# EAGLE design MiniDC2 (EAGLE 7.6.0)
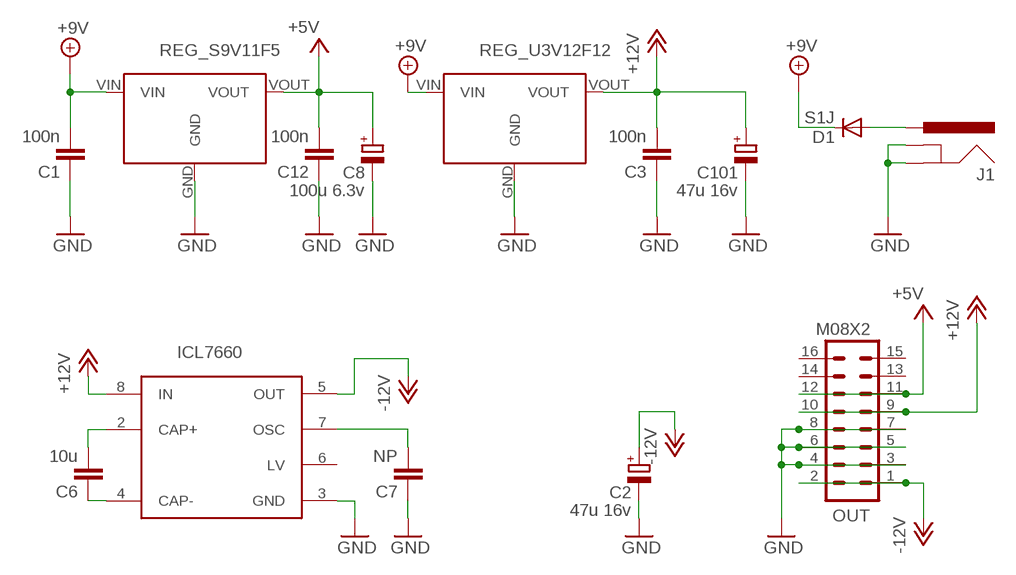
[diagram p0: schematic, sheet 1]

## Parts
C1  100n  C-EUC0603  [C0603]
C2  47u 16v  CPOL-EUB  [PANASONIC_B]
C3  100n  C-EUC0603  [C0603]
C6  10u  C-EUC1206  [C1206]
C7  NP  C-EUC0603  [C0603]
C8  100u 6.3v  CPOL-EUB  [PANASONIC_B]
C12  100n  C-EUC0603  [C0603]
C101  47u 16v  CPOL-EUB  [PANASONIC_B]
D1  S1J  DIODESMA  [SMA-DIODE]
J1  POWER_JACKPTH  [POWER_JACK_PTH]
OUT  M08X2  [2X8]
U1  REG_S9V11F5  [REG_S9V11F5]
U2  REG_U3V12F12  REG_S9V11F5  [REG_S9V11F5]
U3  ICL7660  [SOIC8]

## Nets
+5V: C8.+ C12.2 OUT.11 OUT.12 U1.VOUT
+9V: C1.2 D1.C U1.VIN U2.VIN
+12V: C3.2 C101.+ OUT.9 OUT.10 U2.VOUT U3.8(IN)
-12V: C2.+ OUT.1 OUT.2 U3.5(OUT)
GND: C1.1 C2.- C3.1 C7.1 C8.- C12.1 C101.- J1.GND J1.GNDBREAK OUT.3 OUT.4 OUT.5 OUT.6 OUT.7 OUT.8 U1.GND U2.GND U3.3(GND)
N$2: D1.A J1.PWR
N$3: C6.1 U3.4(CAP-)
N$4: C6.2 U3.2(CAP+)
N$5: C7.2 U3.7(OSC)
Unconnected: OUT.13 OUT.14 OUT.15 OUT.16 U3.6(LV)

## Library data of the parts
C1 C3 C6 C7 C12 = rcl:C-EU: CAPACITOR, European symbol
C2 C8 C101 = Rebel:CPOL-EU: POLARIZED CAPACITOR, European symbol
D1 = SparkFun:DIODE: Diode These are standard reverse protection diodes and small signal diodes. SMA package can handle up to about 1A. SOD-323 can handle about 200mA. What the SOD-323 package when ordering, there are some mfgs out there that are 5-pin packages.
J1 = SparkFun:POWER_JACK: Power Jack This is the standard 5.5mm barrel jack for power. The PTH is the most common, proven, reliable, footprint. All others are experimental. The Slot footprint only works if the mill layer is transmitted to the PCB fab house so be warned. Spark Fun Electronics SKU : PRT-00119. Mating wall wart : TOL-00298 (and others)
OUT = SparkFun:M08X2
U1 U2 = Rebel:REG_S9V11F5
U3 = Rebel:ICL7660

## Net classes
1 power: width 0.178 mm, drill 0.305 mm, clearance 0.178 mm to class 0, clearance 0.178 mm

## Board
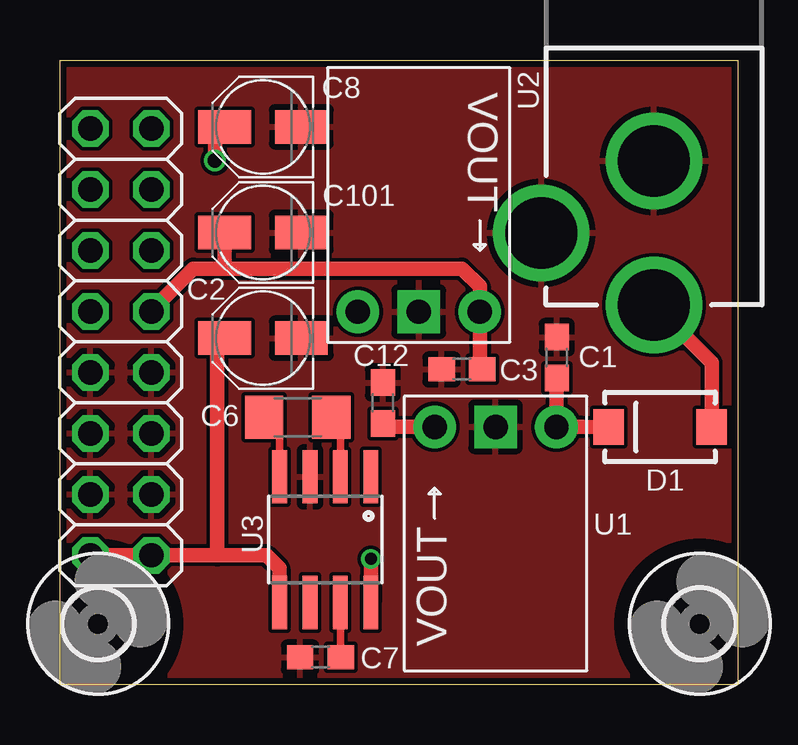
[diagram p1: board, top side]
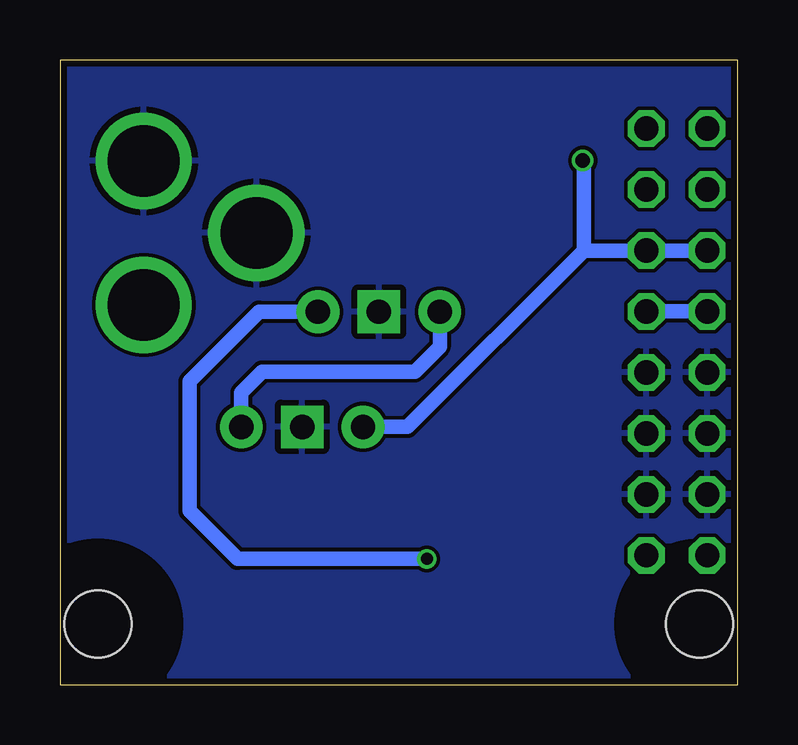
[diagram p2: board, bottom side, seen from below]

Size 28.26 x 26.04 mm. Coordinates in mm from the lower left corner, seen from the top.
Outline: 0,0 0,26.04 28.26,26.04 28.26,0 0,0
Copper layers (1*16): Top 0.035mm / dielectric 1.5mm / Bottom 0.035mm
Design rules "SeeedStudio_2layer_DRU_no_angle_20140221": minimum track width 6mil, minimum drill 12mil, track to track 6mil, track to pad 6mil, pad to pad 6mil, via to via 6mil, smd to smd 0mil, copper to edge 10mil, drill to drill 10mil, minimum pad ring 10mil, minimum via ring 6mil, stop-mask expansion 2mil, vias tented up to drill 100mil, thermal gap 10mil

### Footprints (pad centres in the part's own frame; a part is rotated, then mirrored left to right if it is on the bottom)
C0603 = smd 1.1 x 1: 1 -0.85,0; 2 0.85,0
PANASONIC_B = smd 2.2 x 1.4: + 1.6,0; - -1.6,0
C1206 = smd 1.6 x 1.8: 1 -1.4,0; 2 1.4,0
SMA-DIODE = smd 1.27 x 1.47: A -2.15,0; C 2.15,0
POWER_JACK_PTH = drill 2.997: GND 0,7.7; GNDBREAK 4.7,10.7; PWR 0,13.7
2X8 = drill 1.016 octagon: 1 0,0; 2 0,2.54; 3 2.54,0; 4 2.54,2.54; 5 5.08,0; 6 5.08,2.54; 7 7.62,0; 8 7.62,2.54; 9 10.16,0; 10 10.16,2.54; 11 12.7,0; 12 12.7,2.54; 13 15.24,0; 14 15.24,2.54; 15 17.78,0; 16 17.78,2.54
REG_S9V11F5 = drill 1.016 pad 1.778 square: GND 0,0 | drill 1.016 pad 1.778: VIN -2.54,0; VOUT 2.54,0
SOIC8 = smd 0.61 x 2.21: 1 -1.905,-2.616; 2 -0.635,-2.616; 3 0.635,-2.616; 4 1.905,-2.616; 5 1.905,2.616; 6 0.635,2.616; 7 -0.635,2.616; 8 -1.905,2.616
2,8 = hole 2.8: 0,0

### Placement (x,y rotation side)
C1  20.71,13.64 270 top
C2  8.46,14.45 180 top
C3  16.76,13.15 0 top
C6  9.91,11.15 0 top
C7  10.86,1.15 0 top
C8  8.46,23.25 180 top
C12  13.46,11.75 270 top
C101  8.46,18.85 180 top
D1  25.02,10.74 180 top
J1  24.77,29.53 180 top
OUT  3.81,5.4 90 top
U1  18.16,10.75 180 top
U2  14.96,15.55 0 top
U3  11.06,6.05 180 top
U$2  [2,8]  26.67,2.54 0 top
U$3  [2,8]  1.59,2.54 0 top

### Tracks (layer width: path | path; a pad name or v marks a point on that pad's centre or on a via)
+5V  (via drill 0.6)
  Top 0.61: C12.2 13.51,10.76 U1.VOUT | v6.46,21.85 6.46,22.85 arc-90 C8.+
  Bottom 0.61: OUT.12 OUT.11 6.41,18.1 | U1.VOUT 13.76,10.75 6.41,18.1 | 6.41,18.1 6.41,21.8 v6.46,21.85
+9V
  Top 0.61: C1.2 20.7,12.18 U1.VIN 21.78,10.75 D1.C
  Bottom 0.61: U2.VIN 12.42,14.09 13.46,13.05 19.83,13.05 20.7,12.18 U1.VIN
+12V  (via drill 0.5)
  Top 0.406: 17.5,13.15 C3.2
  Top 0.61: 17.5,13.15 U2.VOUT 17.5,16.61 16.76,17.35 6.86,17.35 | v12.96,5.25 12.96,3.45 12.96,3.44 U3.8 | OUT.9 3.81,15.6 5.56,17.35 6.86,17.35 | C101.+ 6.86,17.35
  Bottom 0.61: OUT.9 OUT.10 | v12.96,5.25 20.86,5.25 22.86,7.25 22.86,12.65 19.96,15.55 U2.VOUT
-12V
  Top 0.61: OUT.2 OUT.1 6.56,5.4 | U3.5 9.16,4.85 8.61,5.4 6.56,5.4 | C2.+ 6.56,14.15 6.56,5.4
GND
  pour Bottom (rank 2): -2.54,-2.22 -2.54,29.53 31.75,29.53 31.75,-2.22
  pour Top (rank 2): 31.96,-2.22 31.96,29.53 -2.33,29.53 -2.33,-2.22
N$2
  Top 0.61: D1.A 27.17,13.42 J1.PWR
N$3
  Top 0.305: U3.4 9.16,10.69 C6.1
N$4
  Top 0.305: U3.2 11.7,10.56 C6.2
N$5
  Top 0.305: U3.7 11.7,1.16 C7.2

### Text on the board
Measures: -12v | -12v